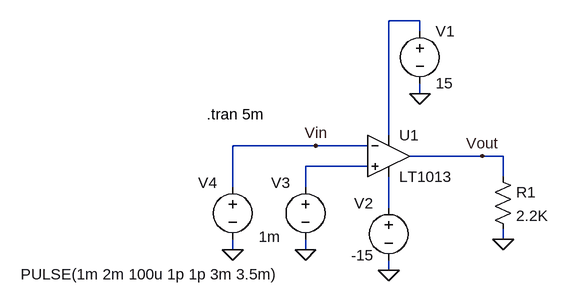
[diagram p0: schematic Opamp for Testing.asc]
Opamp for Testing.asc, the LTspice schematic file:
Version 4
SHEET 1 880 680
WIRE 288 -64 240 -64
WIRE 288 -48 288 -64
WIRE 288 48 288 32
WIRE 240 112 240 -64
WIRE 128 128 0 128
WIRE 208 128 128 128
WIRE 384 144 272 144
WIRE 416 144 384 144
WIRE 208 160 112 160
WIRE 416 176 416 144
WIRE 0 192 0 128
WIRE 112 192 112 160
WIRE 240 224 240 176
WIRE 416 272 416 256
WIRE 0 288 0 272
WIRE 112 288 112 272
WIRE 240 320 240 304
FLAG 288 48 0
FLAG 240 320 0
FLAG 384 144 Vout
FLAG 416 272 0
FLAG 0 288 0
FLAG 112 288 0
FLAG 128 128 Vin
SYMBOL Opamps\\LT1013 240 80 R0
SYMATTR InstName U1
SYMBOL voltage 288 -64 R0
WINDOW 123 0 0 Left 2
WINDOW 39 0 0 Left 2
SYMATTR InstName V1
SYMATTR Value 15
SYMBOL res 400 160 R0
SYMATTR InstName R1
SYMATTR Value 2.2K
SYMBOL voltage 0 176 R0
WINDOW 0 -53 9 Left 2
WINDOW 3 -326 150 Left 2
WINDOW 123 0 0 Left 2
WINDOW 39 0 0 Left 2
SYMATTR InstName V4
SYMATTR Value PULSE(1m 2m 100u 1p 1p 3m 3.5m)
SYMBOL voltage 240 208 R0
WINDOW 0 -53 9 Left 2
WINDOW 3 -58 89 Left 2
WINDOW 123 0 0 Left 2
WINDOW 39 0 0 Left 2
SYMATTR InstName V2
SYMATTR Value -15
SYMBOL voltage 112 176 R0
WINDOW 0 -53 9 Left 2
WINDOW 3 -72 92 Left 2
WINDOW 123 0 0 Left 2
WINDOW 39 0 0 Left 2
SYMATTR InstName V3
SYMATTR Value 1m
TEXT -40 80 Left 2 !.tran 5m

The netlist it stands for:
* Opamp for Testing.asc
XU1 N002 Vin N001 N003 Vout LT1013  ; pins In+ In- V+ V- OUT
V1 N001 0 15
R1 Vout 0 2.2K
V4 Vin 0 PULSE(1m 2m 100u 1p 1p 3m 3.5m)
V2 N003 0 -15
V3 N002 0 1m
.tran 5m
.lib LTC.lib
.backanno
.end